# EAGLE design ardBeeQueenWMountHoles50x52 (EAGLE 9.3.1)
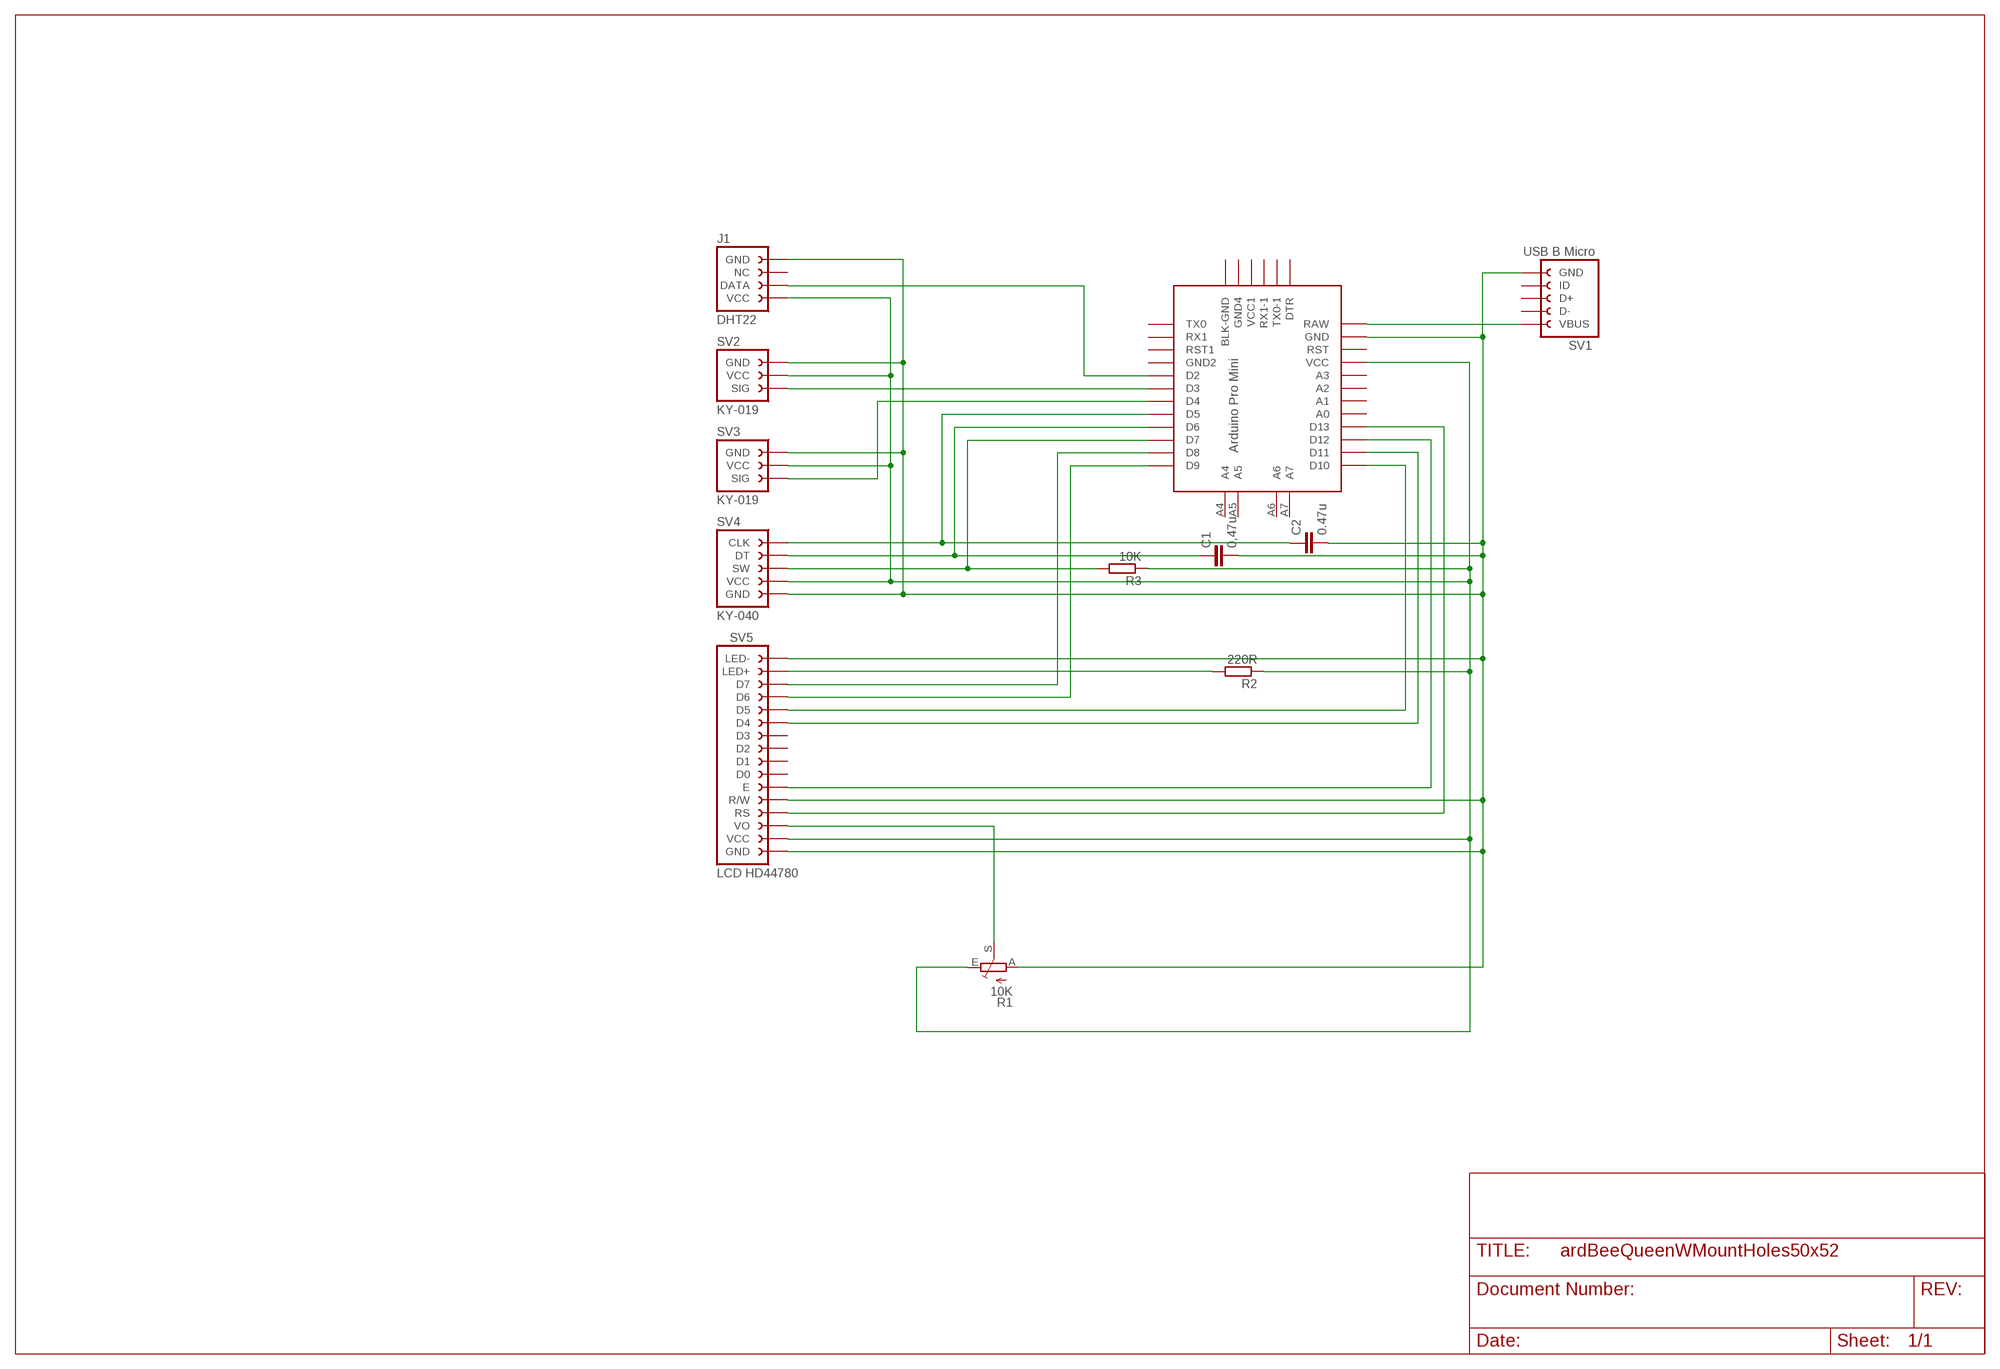
[diagram p0: schematic, sheet 1]

## Parts
C1  0,47u  C-EU050-024X044  [C050-024X044]
C2  0.47u  C-EU050-024X044  [C050-024X044]
J1  DHT22_4-PIN_FEMALE_HEADERPTH  [DHT22_4-PIN_FEMALE_HEADER]
R1  10K  TRIM_EU-B25P  [B25P]
R2  220R  R-EU_0207/10  [0207/10]
R3  10K  R-EU_0207/10  [0207/10]
SV1  MICROUSB_B_BREAKOUT_5-PIN_FEMALE_HEADERWITH_MOUNT_HOLES  [MICROUSB_B_BREAKOUT_5-PIN_FEMALE_HEADER_W_MOUNT_HOLES]
SV2  KY-019_3-PIN_FEMALE_HEADER  [KY-019_3-PIN_FEMALE_HEADER]
SV3  KY-019_3-PIN_FEMALE_HEADER  [KY-019_3-PIN_FEMALE_HEADER]
SV4  KY-040_5-PIN_FEMALE_HEADER  [KY-040_5-PIN_FEMALE_HEADER]
SV5  LCD-HD44780-16-PIN_FEMALE_HEADER  [LCD-HD44780-16-PIN_FEMALE_HEADER]
U$1  ARDUINO_PRO_MINI-2  [ARDUINO_PRO_MINI-2]

## Nets
N$1: R1.S SV5.VO
N$2: R2.2 SV5.LED+
N$3: SV5.D6 U$1.D9
N$4: SV5.D7 U$1.D8
N$5: SV5.D5 U$1.D10
N$6: SV5.D4 U$1.D11
N$7: SV5.E U$1.D12
N$8: SV5.RS U$1.D13
N$9: R3.2 SV4.SW U$1.D7
N$10: C1.1 SV4.DT U$1.D6
N$11: C2.1 SV4.CLK U$1.D5
N$12: J1.DATA U$1.D2
N$13: SV2.SIG U$1.D3
N$14: SV3.SIG U$1.D4
N$15: J1.VCC R1.E R2.1 R3.1 SV2.VCC SV3.VCC SV4.VCC SV5.VCC U$1.VCC
N$16: C1.2 C2.2 J1.GND R1.A SV1.GND SV2.GND SV3.GND SV4.GND SV5.GND SV5.LED- SV5.R/W U$1.GND
N$17: SV1.VBUS U$1.RAW
Unconnected: J1.NC SV1.D+ SV1.D- SV1.ID SV5.D0 SV5.D1 SV5.D2 SV5.D3 U$1.A0 U$1.A1 U$1.A2 U$1.A3 U$1.A4 U$1.A5 U$1.A6 U$1.A7 U$1.BLK-GND U$1.DTR U$1.GND1(GND2) U$1.GND3(GND4) U$1.RST U$1.RST1 U$1.RX1 U$1.RX1-1 U$1.TX0 U$1.TX0-1 U$1.VCC1

## Library data of the parts
C1 C2 = rcl:C-EU: CAPACITOR, European symbol; SPICEPREFIX: C
J1 = myLib-01-Headers:DHT22_4-PIN_FEMALE_HEADER: Header for the DHT22 four pin module. Female; PROD_ID: CONN-09696
R1 = pot:TRIM_EU-: POTENTIOMETER
R2 R3 = rcl:R-EU_: RESISTOR, European symbol; SPICEPREFIX: R
SV1 = myLib-01-Headers:MICROUSB_B_BREAKOUT_5-PIN_FEMALE_HEADER: Header for the micro USB five pin breakout Female
SV2 SV3 = myLib-01-Headers:KY-019_3-PIN_FEMALE_HEADER: Header for the 3 pin KY-019 arduino relay module Female https://www.keyestudio.com/free-shipping-keyestudio-single-5v-relay-module-compatible-with-arduino-uno-r3-mega-p0195-p0195.html https://tkkrlab.nl/wiki/Arduino_KY-019_5V_relay_module Board size: 27 x 34 mm Hole distances: 20.05 x 29 mm Lower edge to lower holes and in pins: 3 mm Hole diameter: 3.5 mm Lower left hole to Sig pin: 11 mm - pin to lower right hole: 4.5 mm Pins reaches 5 mm outside board edge; OC_FARNELL: unknown; OC_NEWARK: unknown
SV4 = myLib-01-Headers:KY-040_5-PIN_FEMALE_HEADER: Header for the 5 pin KY-040 arduino rotary encoder module Female https://www.keyestudio.com/free-shipping-keyestudio-rotary-rotation-encoder-module-for-arduino-p0127.html https://tkkrlab.nl/wiki/Arduino_KY-040_Rotary_encoder_module; OC_FARNELL: unknown; OC_NEWARK: unknown
SV5 = myLib-01-Headers:LCD-HD44780-16-PIN_FEMALE_HEADER: Header for the 16 pin HD44780 LCD module Female; OC_FARNELL: unknown; OC_NEWARK: unknown
U$1 = myLib-02-Arduino:ARDUINO_PRO_MINI-2: Arduino Pro Mini Layout 2 Sparkfun.com

## Net classes
0 default: width 0.406 mm, clearance 0.152 mm

## Board
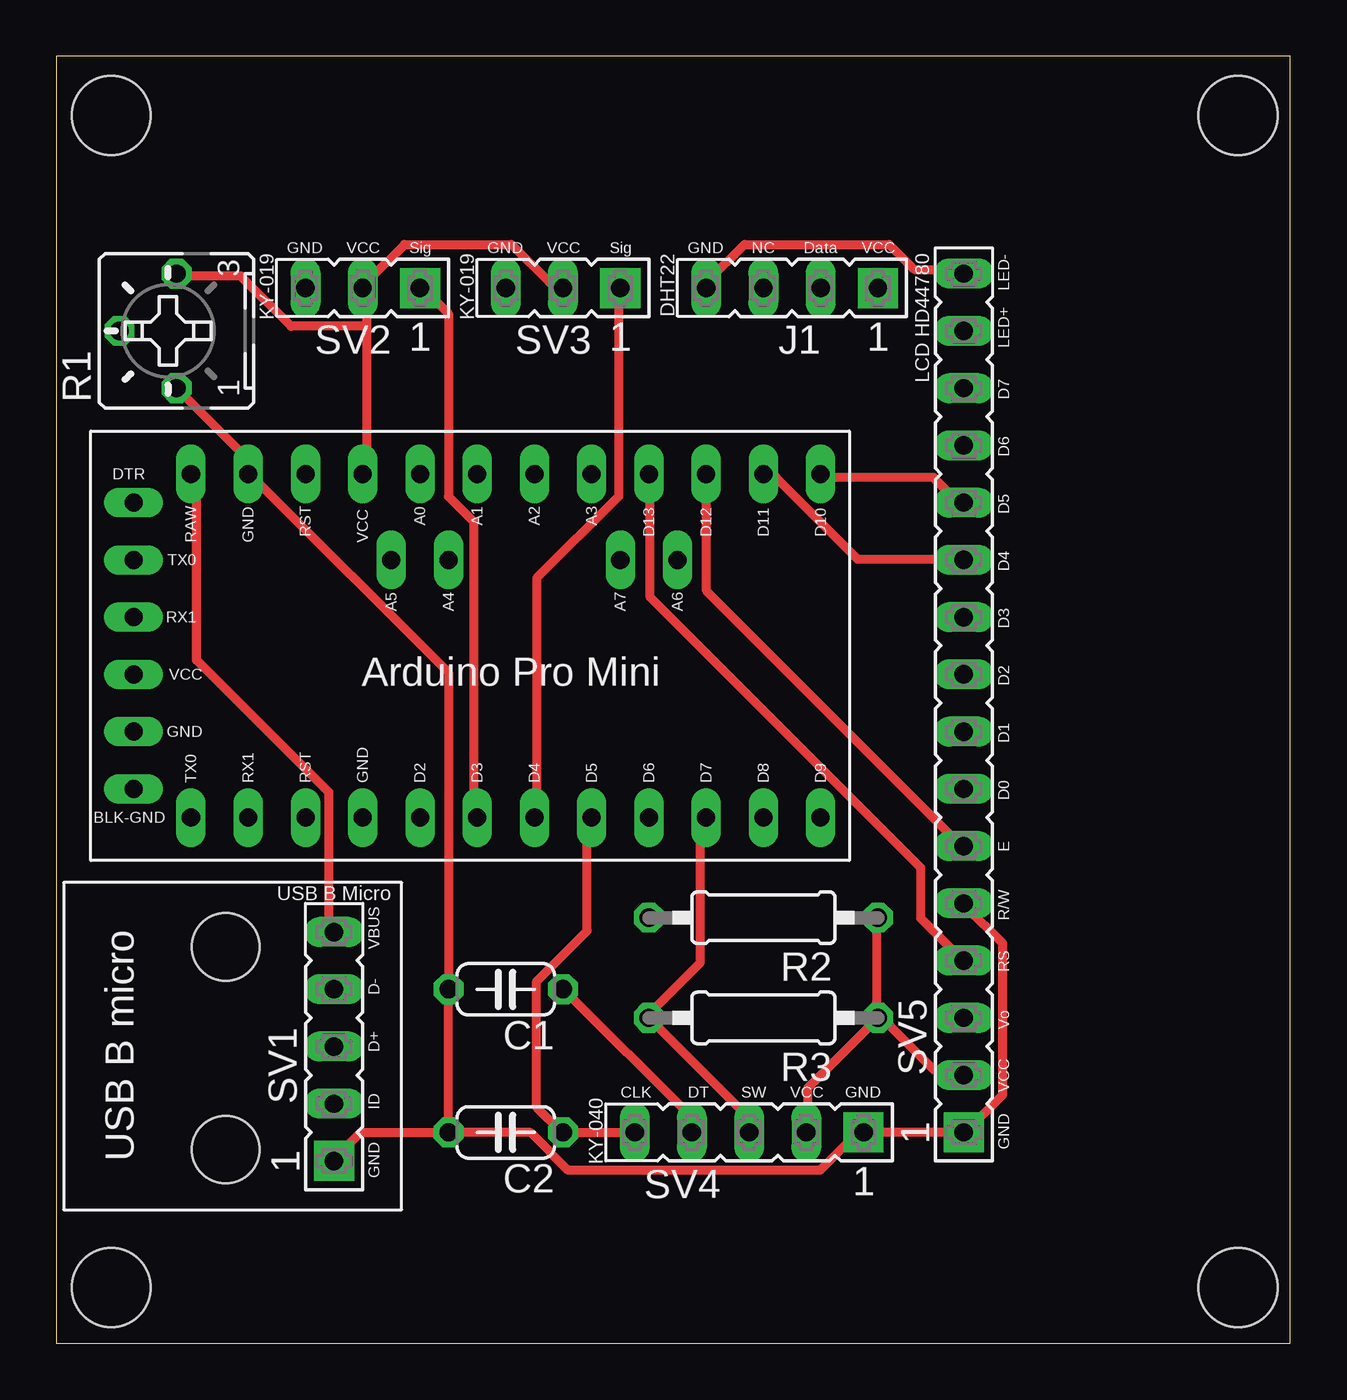
[diagram p1: board, top side]
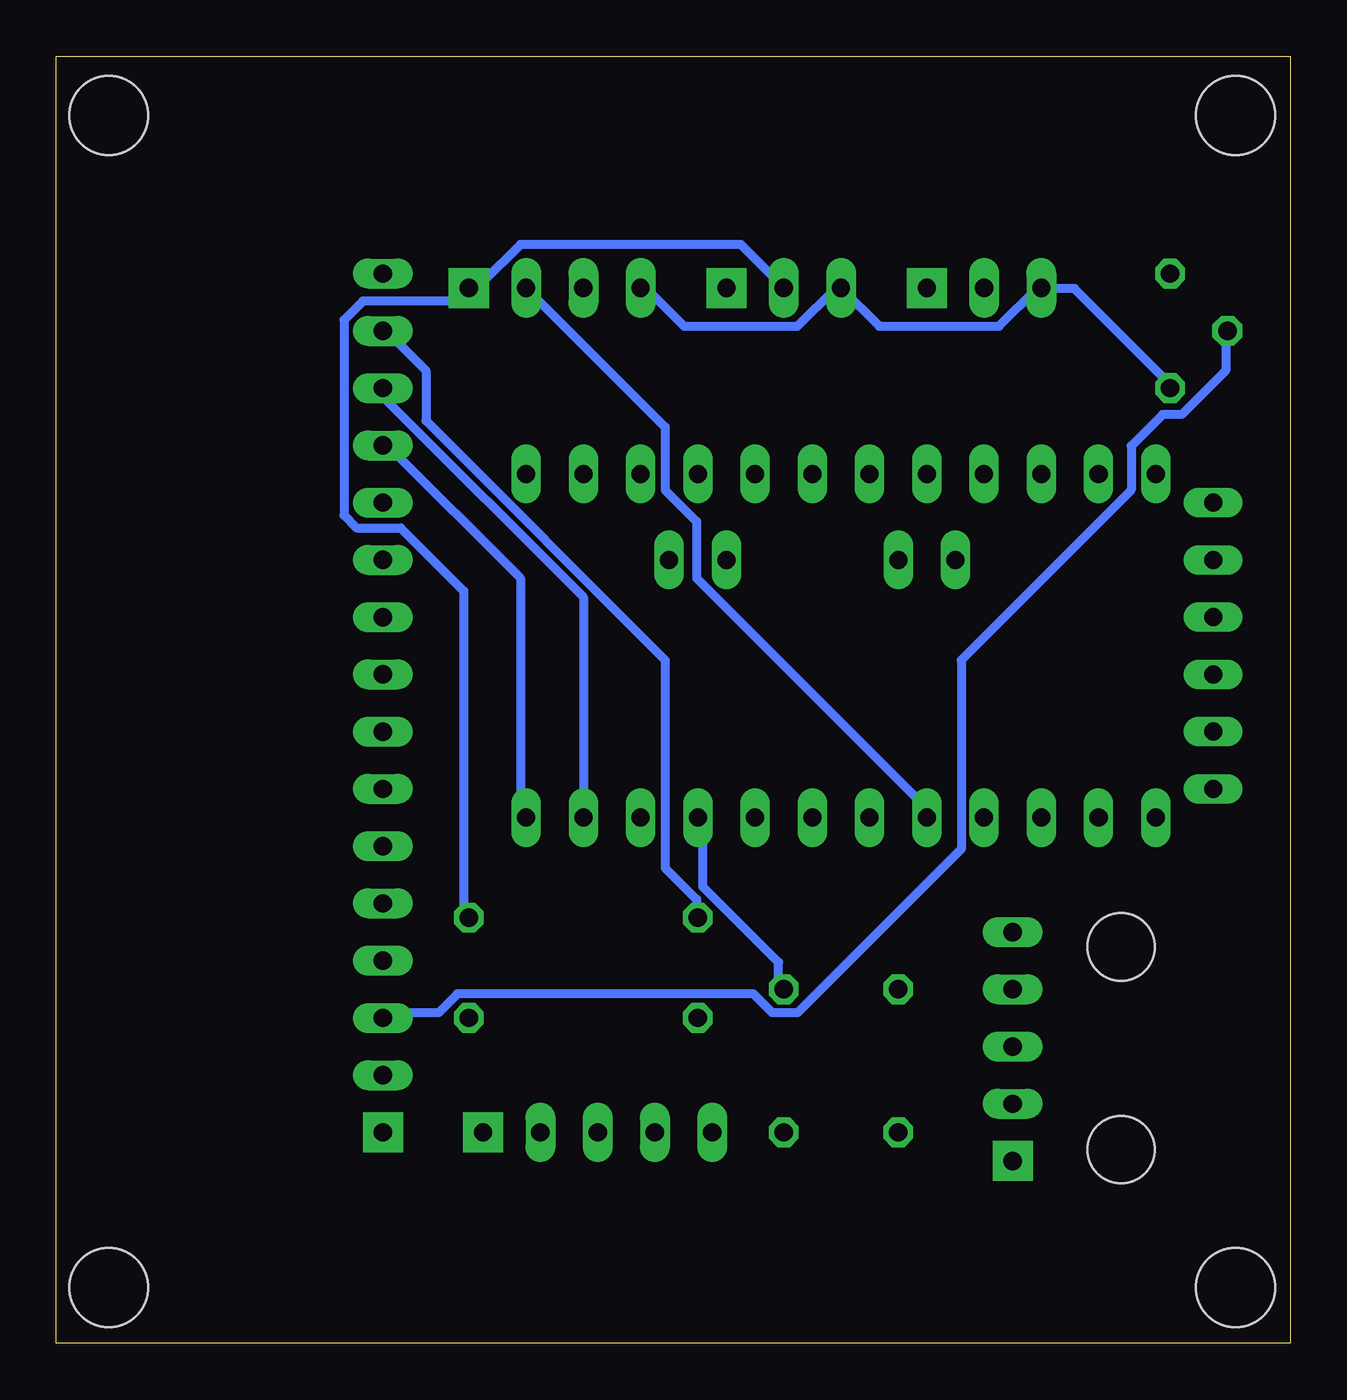
[diagram p2: board, bottom side, seen from below]

Size 54.75 x 57.09 mm. Coordinates in mm from the lower left corner, seen from the top.
Outline: 0,0 54.75,0 54.75,57.09 0,57.09 0,0
Copper layers (1*16): Top 0.035mm / dielectric 1.5mm / Bottom 0.035mm
Design rules "default": minimum track width 6mil, minimum drill 0.35mm, track to track 6mil, track to pad 6mil, pad to pad 6mil, via to via 6mil, smd to smd 6mil, copper to edge 40mil, drill to drill 6mil, minimum pad ring 10mil, minimum via ring 8mil, stop-mask expansion 4mil, vias tented up to drill 0mil, thermal gap 10mil
Holes 3.5 mm at 2.43,54.47 52.43,54.47 52.43,2.47 2.43,2.47

### Footprints (pad centres in the part's own frame; a part is rotated, then mirrored left to right if it is on the bottom)
C050-024X044 = drill 0.813 octagon: 1 -2.54,0; 2 2.54,0
DHT22_4-PIN_FEMALE_HEADER = drill 0.813 long: DATA 2.54,0; GND 7.62,0; NC 5.08,0 | drill 0.813 pad 1.778 square: VCC 0,0
B25P = drill 0.813 octagon: A -2.54,0; E 2.54,0; S 0,2.54
0207/10 = drill 0.813 octagon: 1 -5.08,0; 2 5.08,0
MICROUSB_B_BREAKOUT_5-PIN_FEMALE_HEADER_W_MOUNT_HOLES = drill 0.813 long: D+ 5.08,0; D- 7.62,0; ID 2.54,0; VBUS 10.16,0 | drill 0.813 pad 1.778 square: GND 0,0 | hole 3: 0.508,4.81; 9.508,4.81
KY-019_3-PIN_FEMALE_HEADER = drill 0.813 long: GND 5.08,0; VCC 2.54,0 | drill 0.813 pad 1.778 square: SIG 0,0
KY-040_5-PIN_FEMALE_HEADER = drill 0.813 long: CLK 10.16,0; DT 7.62,0; SW 5.08,0; VCC 2.54,0 | drill 0.813 pad 1.778 square: GND 0,0
LCD-HD44780-16-PIN_FEMALE_HEADER = drill 0.813 long: D0 15.24,0; D1 17.78,0; D2 20.32,0; D3 22.86,0; D4 25.4,0; D5 27.94,0; D6 30.48,0; D7 33.02,0; E 12.7,0; LED+ 35.56,0; LED- 38.1,0; R/W 10.16,0; RS 7.62,0; VCC 2.54,0; VO 5.08,0 | drill 0.813 pad 1.778 square: GND 0,0
ARDUINO_PRO_MINI-2 = drill 0.8 long: A0 6.35,2.54; A1 6.35,0; A2 6.35,-2.54; A3 6.35,-5.08; A4 2.54,1.27; A5 2.54,3.81; A6 2.54,-8.89; A7 2.54,-6.35; BLK-GND -7.62,15.24; D2 -8.89,2.54; D3 -8.89,0; D4 -8.89,-2.54; D5 -8.89,-5.08; D6 -8.89,-7.62; D7 -8.89,-10.16; D8 -8.89,-12.7; D9 -8.89,-15.24; D10 6.35,-15.24; D11 6.35,-12.7; D12 6.35,-10.16; D13 6.35,-7.62; DTR 5.08,15.24; GND 6.35,10.16; GND1 -8.89,5.08; GND3 -5.08,15.24; RAW 6.35,12.7; RST 6.35,7.62; RST1 -8.89,7.62; RX1 -8.89,10.16; RX1-1 0,15.24; TX0 -8.89,12.7; TX0-1 2.54,15.24; VCC 6.35,5.08; VCC1 -2.54,15.24

### Placement (x,y rotation side)
C1  19.94,15.7 180 top
C2  19.94,9.35 180 top
J1  36.45,46.81 180 top
R1  5.33,44.91 90 top
R2  31.37,18.88 180 top
R3  31.37,14.43 180 top
SV1  12.32,8.08 90 top
SV2  16.13,46.81 180 top
SV3  25.02,46.81 180 top
SV4  35.81,9.35 180 top
SV5  40.26,9.35 90 top
U$1  18.67,32.21 90 top

### Tracks (layer width: path | path; a pad name or v marks a point on that pad's centre or on a via)
N$1
  Bottom 0.406: SV5.VO 40.03,14.66 37.8,14.66 36.96,15.5 23.83,15.5 22.99,14.66 21.87,14.66 14.61,21.92 14.61,30.3 7.06,37.85 7.06,39.8 5.67,41.2 4.83,41.2 2.87,43.16 2.87,44.83 R1.S
N$2
  Bottom 0.406: R2.2 26.34,19.13 26.34,19.69 27.74,21.08 27.74,30.3 38.35,40.92 38.35,43.16 40.03,44.83 SV5.LED+
N$3
  Bottom 0.406: U$1.D9 34.16,23.32 34.16,33.94 40.03,39.8 SV5.D6
N$4
  Bottom 0.406: U$1.D8 31.37,33.1 40.03,41.76 40.03,42.32 SV5.D7
N$5
  Top 0.406: U$1.D10 34.16,38.41 38.91,38.41 40.03,37.29 SV5.D5
N$6
  Top 0.406: U$1.D11 31.37,38.41 31.93,38.41 35.56,34.78 40.03,34.78 SV5.D4
N$7
  Top 0.406: U$1.D12 28.86,38.41 28.86,33.38 40.03,22.2 SV5.E
N$8
  Top 0.406: U$1.D13 26.34,38.41 26.34,33.1 38.35,21.08 38.35,18.85 40.03,17.17 SV5.RS
N$9
  Top 0.406: U$1.D7 28.58,23.32 28.58,16.89 26.34,14.66 R3.2 30.53,10.19 30.53,9.35 SV4.SW
N$10
  Top 0.406: SV4.DT 28.02,9.35 28.02,10.19 22.71,15.5 C1.1
  Bottom 0.406: U$1.D6 26.06,23.32 26.06,20.25 22.71,16.89 22.71,15.78 C1.1
N$11
  Top 0.406: U$1.D5 23.55,23.32 23.55,18.29 21.31,16.06 21.31,10.47 22.43,9.35 C2.1 SV4.CLK
N$12
  Bottom 0.406: J1.DATA 27.74,40.64 27.74,37.85 26.34,36.45 26.34,33.94 16.28,23.88 16.28,23.32 U$1.D2
N$13
  Top 0.406: U$1.D3 18.52,23.32 18.52,36.45 17.4,37.57 17.4,45.67 16.28,46.79 SV2.SIG
N$14
  Top 0.406: U$1.D4 21.31,23.32 21.31,33.94 24.94,37.57 24.94,46.79 SV3.SIG
N$15
  Top 0.406: R3.1 33.33,11.31 33.33,9.35 SV4.VCC | SV5.VCC 40.03,12.14 38.91,12.14 36.68,14.38 R3.1 | R2.1 36.4,18.85 36.4,14.66 R3.1 | 13.77,45.11 13.77,46.79 SV2.VCC 13.77,47.07 15.44,48.75 20.19,48.75 21.87,47.07 22.43,47.07 SV3.VCC | 13.77,45.11 13.77,38.69 U$1.VCC | 13.77,45.11 10.42,45.11 8.18,47.35 5.39,47.35 R1.E
  Bottom 0.406: SV3.VCC 22.71,47.07 24.38,48.75 34.16,48.75 35.84,47.07 36.4,47.07 J1.VCC 36.68,46.79 37.24,46.23 41.15,46.23 41.99,45.39 41.99,36.73 41.43,36.17 39.47,36.17 36.68,33.38 36.68,19.13 R2.1
N$16
  Top 0.406: C2.2 13.49,9.35 12.37,8.23 SV1.GND | C2.2 C1.2 17.4,29.75 8.74,38.41 U$1.GND 8.46,38.69 8.46,39.25 R1.A | SV5.R/W 40.31,19.41 41.99,17.73 41.99,11.03 40.31,9.35 SV5.GND SV4.GND 35.56,9.35 33.88,7.67 22.71,7.67 21.03,9.35 C2.2 | SV5.LED- 40.03,47.63 38.08,47.63 36.96,48.75 30.53,48.75 28.86,47.07 J1.GND
  Bottom 0.406: R1.A 5.39,42.6 9.58,46.79 10.97,46.79 SV2.GND 11.25,46.79 12.93,45.11 18.24,45.11 SV3.GND 20.19,46.79 21.87,45.11 26.9,45.11 28.58,46.79 J1.GND
N$17
  Top 0.406: U$1.RAW 6.22,38.41 6.22,30.3 12.09,24.44 12.09,18.29 SV1.VBUS